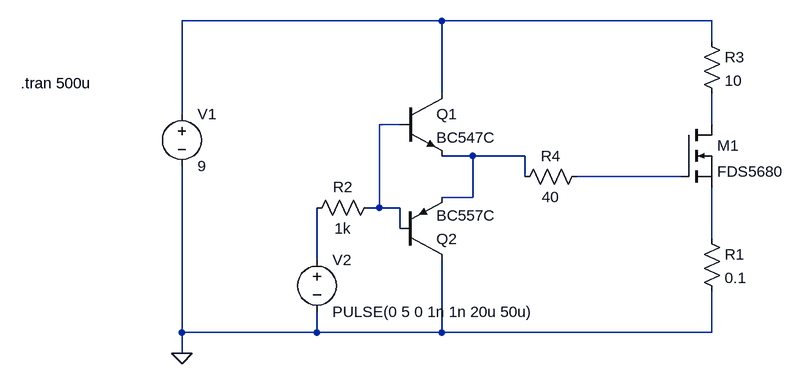
[diagram p0: schematic leddriver-20120912-mosfet.asc]
leddriver-20120912-mosfet.asc, the LTspice schematic file:
Version 4
SHEET 1 1460 680
WIRE -352 -64 -752 -64
WIRE 64 -64 -352 -64
WIRE 64 -32 64 -64
WIRE -352 48 -352 -64
WIRE -752 80 -752 -64
WIRE -416 96 -448 96
WIRE 64 96 64 48
WIRE -304 144 -352 144
WIRE -224 144 -304 144
WIRE -224 176 -224 144
WIRE 16 176 -144 176
WIRE -304 208 -304 144
WIRE -304 208 -352 208
WIRE -448 224 -448 96
WIRE -448 224 -464 224
WIRE -416 224 -448 224
WIRE -416 256 -416 224
WIRE 64 272 64 192
WIRE -544 304 -544 224
WIRE -752 416 -752 160
WIRE -544 416 -544 384
WIRE -544 416 -752 416
WIRE -352 416 -352 304
WIRE -352 416 -544 416
WIRE 64 416 64 352
WIRE 64 416 -352 416
WIRE -752 448 -752 416
FLAG -752 448 0
SYMBOL voltage -752 64 R0
WINDOW 123 0 0 Left 2
WINDOW 39 0 0 Left 2
SYMATTR InstName V1
SYMATTR Value 9
SYMBOL voltage -544 288 R0
WINDOW 123 0 0 Left 2
WINDOW 39 0 0 Left 2
SYMATTR InstName V2
SYMATTR Value PULSE(0 5 0 1n 1n 20u 50u)
SYMBOL res -448 208 R90
WINDOW 0 0 56 VBottom 2
WINDOW 3 32 56 VTop 2
SYMATTR InstName R2
SYMATTR Value 1k
SYMBOL npn -416 48 R0
SYMATTR InstName Q1
SYMATTR Value BC547C
SYMBOL pnp -416 304 M180
SYMATTR InstName Q2
SYMATTR Value BC557C
SYMBOL res -128 160 R90
WINDOW 0 0 56 VBottom 2
WINDOW 3 32 56 VTop 2
SYMATTR InstName R4
SYMATTR Value 40
SYMBOL nmos 16 96 R0
SYMATTR InstName M1
SYMATTR Value FDS5680
SYMBOL res 48 256 R0
SYMATTR InstName R1
SYMATTR Value 0.1
SYMBOL res 48 -48 R0
SYMATTR InstName R3
SYMATTR Value 10
TEXT -1000 32 Left 2 !.tran 500u

The netlist it stands for:
* leddriver-20120912-mosfet.asc
V1 N001 0 9
V2 N007 0 PULSE(0 5 0 1n 1n 20u 50u)
R2 N002 N007 1k
Q1 N001 N002 N004 0 BC547C
Q2 0 N002 N004 0 BC557C
R4 N005 N004 40
M1 N003 N005 N006 N006 FDS5680
R1 N006 0 0.1
R3 N001 N003 10
.model NPN NPN
.model PNP PNP
.lib standard.bjt
.model NMOS NMOS
.model PMOS PMOS
.lib standard.mos
.tran 500u
.backanno
.end